# EAGLE design TapTempoMini (EAGLE 7.5.0)
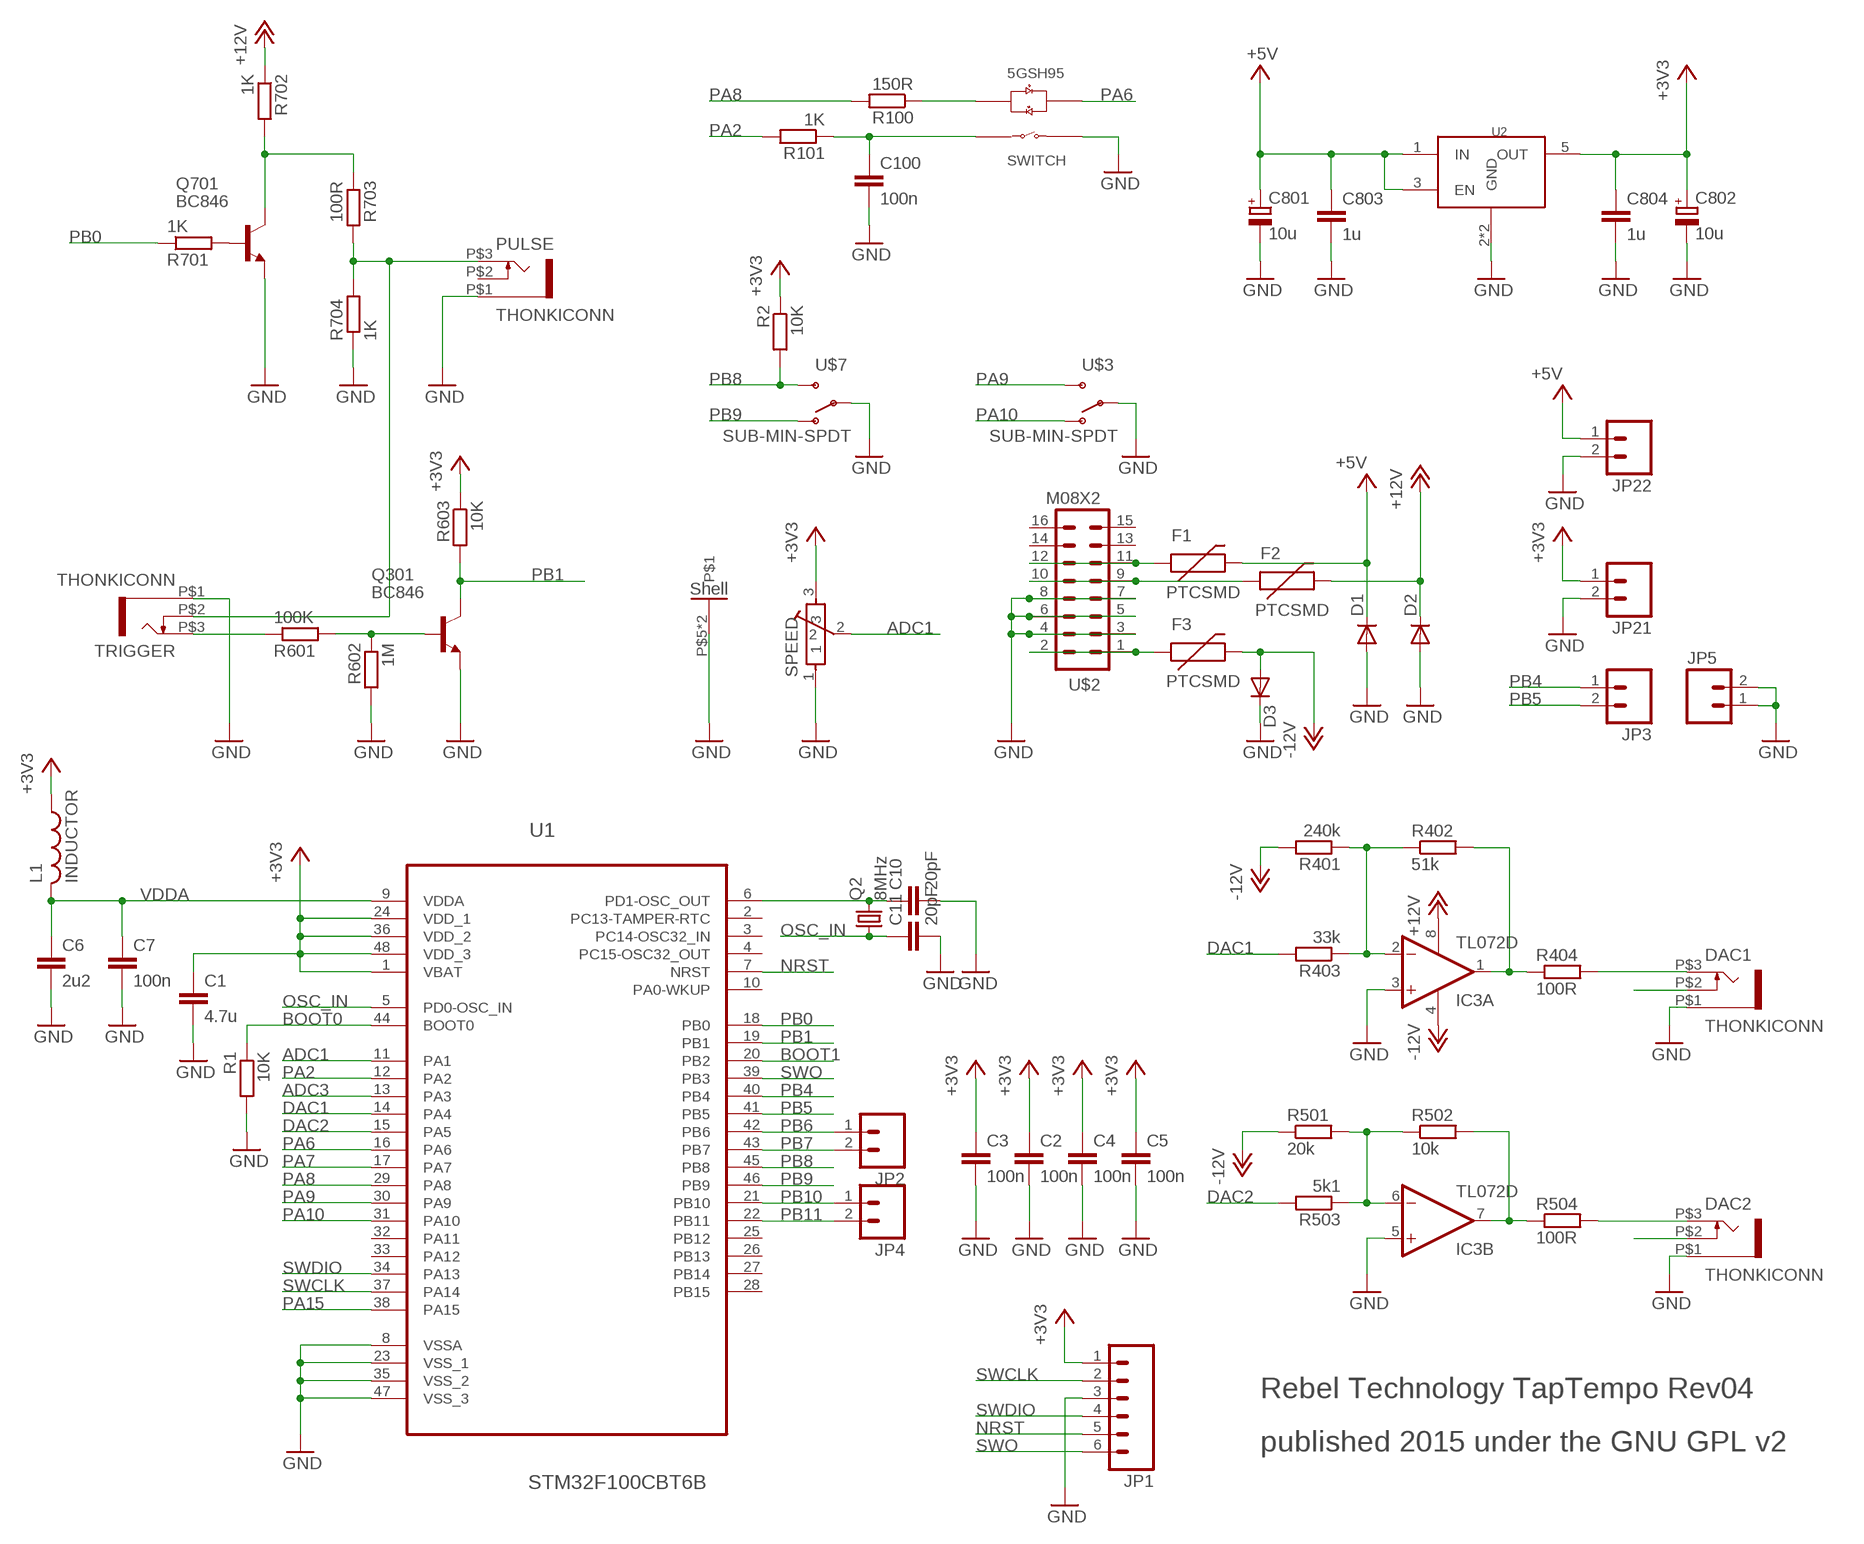
[diagram p0: schematic, sheet 1]

## Parts
C1  4.7u  C-EUC0603  [C0603]
C2  100n  C-EUC0603  [C0603]
C3  100n  C-EUC0603  [C0603]
C4  100n  C-EUC0603  [C0603]
C5  100n  C-EUC0603  [C0603]
C6  2u2  C-EUC0603  [C0603]
C7  100n  C-EUC0603  [C0603]
C10  20pF  C-EUC0603  [C0603]
C11  20pF  C-EUC0603  [C0603]
C100  100n  C-EUC0603  [C0603]
C801  10u  CPOL-EUSANYO_SMD_A5  [SANYO-OSCON_SMD_A5]
C802  10u  CPOL-EUSANYO_SMD_A5  [SANYO-OSCON_SMD_A5]
C803  1u  C-EUC0603  [C0603]
C804  1u  C-EUC0603  [C0603]
D1  DIODESMA  [SMA-DIODE]
D2  DIODESMA  [SMA-DIODE]
D3  DIODESMA  [SMA-DIODE]
DAC1  THONKICONN  [THONKICONN]
DAC2  THONKICONN  [THONKICONN]
F1  PTCSMD  [PTC-1206]
F2  PTCSMD  [PTC-1206]
F3  PTCSMD  [PTC-1206]
IC3  TL072D  [SO08]
JP1  M06SIP  [1X06]
JP2  M02PTH  [1X02]
JP3  M02PTH  [1X02]
JP4  M02PTH  [1X02]
JP5  M02PTH  [1X02]
JP21  M02PTH  [1X02]
JP22  M02PTH  [1X02]
L1  INDUCTOR  [0603]
PULSE  THONKICONN  [THONKICONN]
Q2  8MHz  CRYSTALHC49UP  [HC49UP]
Q301  BC846  [SOT23]
Q701  BC846  [SOT23]
R1  10K  R-EU_R0603  [R0603]
R2  10K  R-EU_R0603  [R0603]
R100  150R  R-EU_0603  [0603]
R101  1K  R-EU_R0603  [R0603]
R401  240k  R-EU_R0603  [R0603]
R402  51k  R-EU_R0603  [R0603]
R403  33k  R-EU_R0603  [R0603]
R404  100R  R-EU_R0603  [R0603]
R501  20k  R-EU_R0603  [R0603]
R502  10k  R-EU_R0603  [R0603]
R503  5k1  R-EU_R0603  [R0603]
R504  100R  R-EU_R0603  [R0603]
R601  100K  R-EU_R0603  [R0603]
R602  1M  R-EU_R0603  [R0603]
R603  10K  R-EU_R0603  [R0603]
R701  1K  R-EU_R0603  [R0603]
R702  1K  R-EU_R0603  [R0603]
R703  100R  R-EU_R0603  [R0603]
R704  1K  R-EU_R0603  [R0603]
SPEED  POT-ALPS-RK09L1140  [POT-ALPS-RK09L1140]
TRIGGER  THONKICONN  [THONKICONN]
U1  STM32F100CBT6B  [QFP50P900X900X160-48N]
U2  NCP702  [TSOP-5]
U$1  5GTH9  [5GTH9]
U$2  M08X2  [2X8]
U$3  SUB-MIN-SPDT  [SUB-MIN-SPDT]
U$7  SUB-MIN-SPDT  [SUB-MIN-SPDT]

## Nets
+3V3: C1.1 C2.1 C3.1 C4.1 C5.1 C802.+ C804.1 JP1.1 JP21.1 L1.1 R2.1 R603.1 SPEED.3 U1.1(VBAT) U1.24(VDD_1) U1.36(VDD_2) U1.48(VDD_3) U2.5(OUT)
+5V: C801.+ C803.1 D1.C F1.2 JP22.1 U2.1(IN) U2.3(EN)
+12V: D2.C F2.2 IC3.8(P:V+) R702.1
-12V: D3.A F3.2 IC3.4(P:V-) R401.2 R501.1
ADC1: SPEED.2 U1.11(PA1)
ADC3: U1.13(PA3)
BOOT0: R1.1 U1.44(BOOT0)
BOOT1: U1.20(PB2)
DAC1: R403.2 U1.14(PA4)
DAC2: R503.2 U1.15(PA5)
GND: C1.2 C2.2 C3.2 C4.2 C5.2 C6.2 C7.2 C10.2 C11.2 C100.2 C801.- C802.- C803.2 C804.2 D1.A D2.A D3.C DAC1.P$1 DAC2.P$1 IC3.3(A:+IN) IC3.5(B:+IN) JP1.3 JP5.1 JP5.2 JP21.2 JP22.2 PULSE.P$1 Q301.2(E) Q701.2(E) R1.2 R602.2 R704.1 SPEED.1 SPEED.P$5 SPEED.P$6 TRIGGER.P$1 U1.8(VSSA) U1.23(VSS_1) U1.35(VSS_2) U1.47(VSS_3) U2.2(GND) U2.4(GND) U$1.1(SWITCH_B) U$2.3 U$2.4 U$2.5 U$2.6 U$2.7 U$2.8 U$3.2(P) U$7.2(P)
N$1: C10.1 Q2.2 U1.6(PD1-OSC_OUT)
N$2: R100.1 U$1.-2(LED_G+)
N$3: IC3.7(B:OUT) R502.2 R504.1
N$4: IC3.6(B:-IN) R501.2 R502.1 R503.1
N$5: PULSE.P$3 R703.2 R704.2 TRIGGER.P$2
N$6: F3.1 U$2.1 U$2.2
N$7: IC3.1(A:OUT) R402.2 R404.1
N$8: DAC1.P$2
N$13: IC3.2(A:-IN) R401.1 R402.1 R403.1
N$23: R601.1 TRIGGER.P$3
N$27: Q301.1(B) R601.2 R602.1
N$29: DAC2.P$2
N$31: DAC1.P$3 R404.2
N$32: DAC2.P$3 R504.2
N$34: Q701.1(B) R701.2
N$38: Q701.3(C) R702.2 R703.1
N$44: F1.1 U$2.11 U$2.12
N$45: F2.1 U$2.9 U$2.10
NRST: JP1.5 U1.7(NRST)
OSC_IN: C11.1 Q2.1 U1.5(PD0-OSC_IN)
PA2: R101.2 U1.12(PA2)
PA6: U1.16(PA6) U$1.+3(LED_R+)
PA7: U1.17(PA7)
PA8: R100.2 U1.29(PA8)
PA9: U1.30(PA9) U$3.3(S)
PA10: U1.31(PA10) U$3.1(O)
PA15: U1.38(PA15)
PB0: R701.1 U1.18(PB0)
PB1: Q301.3(C) R603.2 U1.19(PB1)
PB4: JP3.1 U1.40(PB4)
PB5: JP3.2 U1.41(PB5)
PB6: JP2.1 U1.42(PB6)
PB7: JP2.2 U1.43(PB7)
PB8: R2.2 U1.45(PB8) U$7.3(S)
PB9: U1.46(PB9) U$7.1(O)
PB10: JP4.1 U1.21(PB10)
PB11: JP4.2 U1.22(PB11)
SWCLK: JP1.2 U1.37(PA14)
SWDIO: JP1.4 U1.34(PA13)
SWITCH_A: C100.1 R101.1 U$1.4(SWITCH_A)
SWO: JP1.6 U1.39(PB3)
VDDA: C6.1 C7.1 L1.2 U1.9(VDDA)
Unconnected: PULSE.P$2 U1.2(PC13-TAMPER-RTC) U1.3(PC14-OSC32_IN) U1.4(PC15-OSC32_OUT) U1.10(PA0-WKUP) U1.25(PB12) U1.26(PB13) U1.27(PB14) U1.28(PB15) U1.32(PA11) U1.33(PA12) U$2.13 U$2.14 U$2.15 U$2.16

## Notes on the sheet
- Rebel Technology TapTempo Rev04
- published 2015 under the GNU GPL v2

## Library data of the parts
C1-C7 C10 C11 C100 C803 C804 = resistor:C-EU: CAPACITOR, European symbol
C801 C802 = rcl:CPOL-EU: POLARIZED CAPACITOR, European symbol
D1-D3 = SparkFun:DIODE: Diode These are standard reverse protection diodes and small signal diodes. SMA package can handle up to about 1A. SOD-323 can handle about 200mA. What the SOD-323 package when ordering, there are some mfgs out there that are 5-pin packages.
DAC1 DAC2 PULSE TRIGGER = Rebel:THONKICONN
F1-F3 = SparkFun:PTC: Resettable Fuse PTC Resettable Fuse. Spark Fun Electronics SKU : COM-08357
IC3 = linear:TL072: OP AMP
JP1 = SparkFun:M06: Header 6 Standard 6-pin 0.1" header. Use with straight break away headers (SKU : PRT-00116), right angle break away headers (PRT-00553), swiss pins (PRT-00743), machine pins (PRT-00117), and female headers (PRT-00115). Molex polarized connector foot print use with SKU : PRT-08094 with associated crimp pins and housings. NOTES ON THE VARIANTS LOCK and LOCK_LONGPADS... This footprint was designed to help hold the alignment of a through-hole component (i.e. 6-pin header) while soldering it into place. You may notice that each hole has been shifted either up or down by 0.005 of an inch from it's more standard position (which is a perfectly straight line). This slight alteration caused the pins (the squares in the middle) to touch the edges of the holes. Because they are alternating, it causes a "brace" to hold the component in place. 0.005 has proven to be the perfect amount of "off-center" position when using our standard breakaway headers. Although looks a little odd when you look at the bare footprint, once you have a header in there, the alteration is very hard to notice. Also, if you push a header all the way into place, it is covered up entirely on the bottom side. This idea of altering the position of holes to aid alignment will be further integrated into the Sparkfun Library for other footprints. It can help hold any component with 3 or more connection pins.
JP2-JP5 JP21 JP22 = SparkFun:M02: Header 2 Standard 2-pin 0.1" header. Use with straight break away headers (SKU : PRT-00116), right angle break away headers (PRT-00553), swiss pins (PRT-00743), machine pins (PRT-00117), and female headers (PRT-00115). Molex polarized connector foot print use with SKU : PRT-08233 with associated crimp pins and housings.
L1 = Rebel:INDUCTOR
Q2 = crystal:CRYSTAL: CRYSTAL; FARNELL: 206-3972; OC_FARNELL: unknown; OC_NEWARK: unknown
Q301 Q701 = transistor:BC846: NPN TRANSISTOR
R1 R2 R101 R401-R404 R501-R504 R601-R603 R701-R704 = resistor:R-EU_: RESISTOR, European symbol
R100 = Rebel:R-EU_: RESISTOR, European symbol
SPEED = Rebel:POT-ALPS-RK09L
U1 = Rebel:STM32F100CBT6B: ARM-based 32-bit MCU; MPN: STM32F100CBT6B; OC_FARNELL: 1838512; OC_NEWARK: 86R1308; PACKAGE: LQFP-48; SUPPLIER: STMircroelectronics
U2 = Rebel:NCP702
U$1 = SWITCH-5GTH9:5GTH9
U$2 = SparkFun:M08X2
U$3 U$7 = Rebel:SUB-MIN-SPDT

## Board
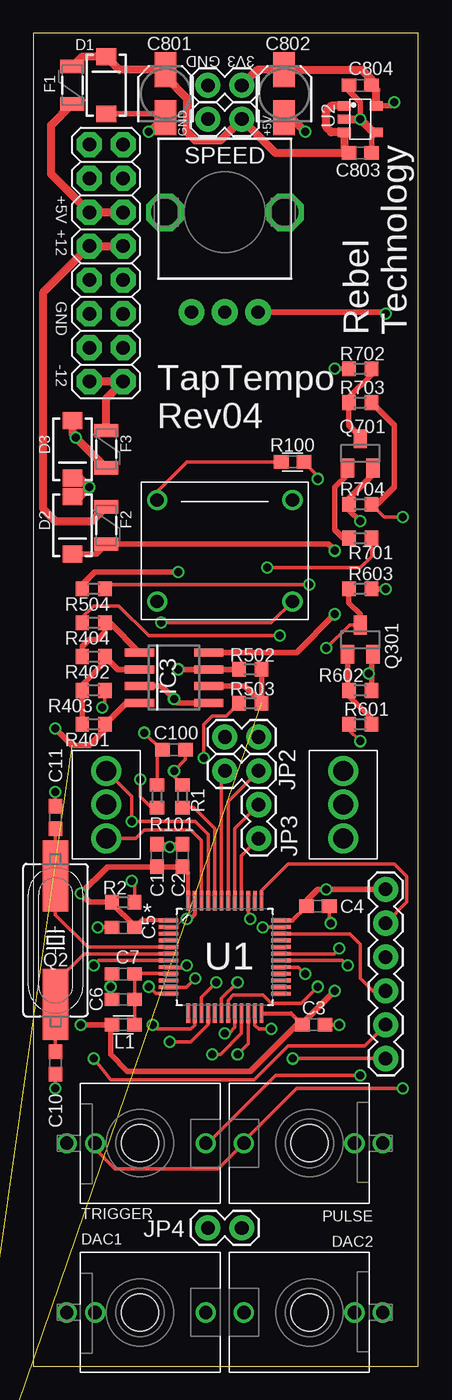
[diagram p1: board, top side]
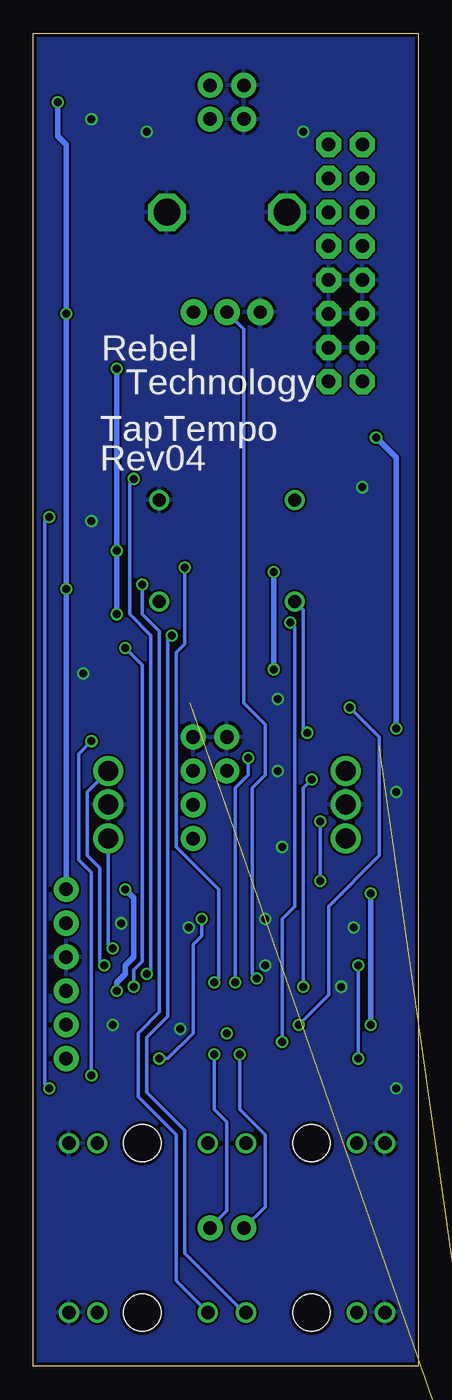
[diagram p2: board, bottom side, seen from below]

Size 28.88 x 100 mm. Coordinates in mm from the lower left corner, seen from the top.
Outline: 28.88,0 28.88,100 0,100 0,0 28.88,0
Copper layers (1+16): Top 0.035mm / dielectric 1.5mm / Bottom 0.035mm
Design rules "Rebel *": minimum track width 6mil, minimum drill 12mil, track to track 6mil, track to pad 6mil, pad to pad 6mil, via to via 6mil, smd to smd 0mil, copper to edge 10mil, drill to drill 10mil, minimum pad ring 10mil, minimum via ring 6mil, stop-mask expansion 2mil, vias tented up to drill 100mil, thermal gap 10mil

### Footprints (pad centres in the part's own frame; a part is rotated, then mirrored left to right if it is on the bottom)
C0603 = smd 1.1 x 1: 1 -0.85,0; 2 0.85,0
SANYO-OSCON_SMD_A5 = smd 2.6 x 1.6: + 1.8,0; - -1.8,0
SMA-DIODE = smd 1.27 x 1.47: A -2.15,0; C 2.15,0
THONKICONN = drill 1: P$1 0,-5.5; P$2 0,-3.38; P$3 0,4.92 | hole 2.8: 0,0
PTC-1206 = smd 1 x 1.8: 1 -1.4,0; 2 1.4,0
SO08 = smd 0.6 x 2.2: 1 -1.905,-2.6; 2 -0.635,-2.6; 3 0.635,-2.6; 4 1.905,-2.6; 5 1.905,2.6; 6 0.635,2.6; 7 -0.635,2.6; 8 -1.905,2.6
1X06 = drill 1.016 pad 1.88: 1 0,0; 2 2.54,0; 3 5.08,0; 4 7.62,0; 5 10.16,0; 6 12.7,0
1X02 = drill 1.016 pad 1.88: 1 0,0; 2 2.54,0
0603 = smd 1.1 x 1: 1 -0.85,0; 2 0.85,0
HC49UP = smd 5.334 x 1.93: 1 -4.826,0; 2 4.826,0
SOT23 = smd 1 x 1.4: 1 -0.95,-1.1; 2 0.95,-1.1; 3 0,1.1
R0603 = smd 1 x 1.1: 1 -0.85,0; 2 0.85,0
POT-ALPS-RK09L1140 = drill 1 pad 1.93: 1 -2.5,-7.5; 2 0,-7.5; 3 2.5,-7.5 | drill 2 octagon: P$5 -4.5,0; P$6 4.5,0
QFP50P900X900X160-48N = smd 1.473 x 0.279: 1 -4.216,2.743; 2 -4.216,2.261; 3 -4.216,1.753; 4 -4.216,1.245; 5 -4.216,0.762; 6 -4.216,0.254; 7 -4.216,-0.254; 8 -4.216,-0.762; 9 -4.216,-1.245; 10 -4.216,-1.753; 11 -4.216,-2.261; 12 -4.216,-2.743; 25 4.216,-2.743; 26 4.216,-2.261; 27 4.216,-1.753; 28 4.216,-1.245; 29 4.216,-0.762; 30 4.216,-0.254; 31 4.216,0.254; 32 4.216,0.762; 33 4.216,1.245; 34 4.216,1.753; 35 4.216,2.261; 36 4.216,2.743 | smd 0.279 x 1.473: 13 -2.743,-4.216; 14 -2.261,-4.216; 15 -1.753,-4.216; 16 -1.245,-4.216; 17 -0.762,-4.216; 18 -0.254,-4.216; 19 0.254,-4.216; 20 0.762,-4.216; 21 1.245,-4.216; 22 1.753,-4.216; 23 2.261,-4.216; 24 2.743,-4.216; 37 2.743,4.216; 38 2.261,4.216; 39 1.753,4.216; 40 1.245,4.216; 41 0.762,4.216; 42 0.254,4.216; 43 -0.254,4.216; 44 -0.762,4.216; 45 -1.245,4.216; 46 -1.753,4.216; 47 -2.261,4.216; 48 -2.743,4.216
TSOP-5 = smd 0.7 x 1: 1 -0.99,-1.2; 2 0,-1.2; 3 0.99,-1.2; 4 0.99,1.2; 5 -0.99,1.2
5GTH9 = drill 1: 1 5.08,3.81; 4 -5.08,-3.81; +3 5.08,-3.81; -2 -5.08,3.81
2X8 = drill 1.016 pad 1.88 octagon: 1 0,0; 2 0,2.54; 3 2.54,0; 4 2.54,2.54; 5 5.08,0; 6 5.08,2.54; 7 7.62,0; 8 7.62,2.54; 9 10.16,0; 10 10.16,2.54; 11 12.7,0; 12 12.7,2.54; 13 15.24,0; 14 15.24,2.54; 15 17.78,0; 16 17.78,2.54
SUB-MIN-SPDT = drill 1.5: 1 0,-2.54; 2 0,0; 3 0,2.54

### Placement (x,y rotation side)
C1  9.28,38.32 90 top
C2  11.19,38.32 90 top
C3  21.03,25.62 0 top
C4  21.35,34.51 0 top
C5  6.74,32.92 180 top
C6  6.74,27.52 180 top
C7  6.74,29.43 180 top
C10  1.66,22.76 270 top
C11  1.66,41.17 90 top
C100  10.55,46.25 0 top
C801  9.91,95.47 90 top
C802  18.8,95.47 90 top
C803  24.52,91.02 0 top
C804  24.52,96.1 180 top
D1  5.47,96.1 90 top
D2  2.93,63.08 270 top
D3  2.93,68.8 270 top
DAC1  8.01,4.03 270 top
DAC2  20.71,4.03 90 top
F1  2.93,96.1 90 top
F2  5.47,63.08 270 top
F3  5.47,68.8 270 top
IC3  10.55,51.65 270 top
JP1  26.43,35.78 270 top
JP2  16.9,44.67 180 top
JP3  16.9,39.59 90 top
JP4  13.09,10.38 0 top
JP5  14.36,47.21 0 top
JP21  15.63,96.1 180 top
JP22  15.63,93.56 180 top
L1  6.74,25.62 0 top
PULSE  20.71,16.73 90 top
Q2  1.66,31.97 270 top
Q301  24.52,54.51 0 top
Q701  24.52,68.48 0 top
R1  11.19,42.76 90 top
R2  6.74,34.82 0 top
R100  19.44,67.84 0 top
R101  9.28,42.76 270 top
R401  4.52,48.16 0 top
R402  4.52,53.24 180 top
R403  4.52,50.7 0 top
R404  4.52,55.78 180 top
R501  -4.05,-8.67 0 top  (outside the outline)
R502  16.27,52.29 180 top
R503  16.27,49.75 180 top
R504  4.52,58.32 0 top
R601  24.52,48.16 0 top
R602  24.52,50.7 0 top
R603  24.52,58.32 180 top
R701  24.52,62.13 180 top
R702  24.52,74.83 0 top
R703  24.52,72.29 0 top
R704  24.52,64.67 0 top
SPEED  14.36,86.58 0 top
TRIGGER  8.01,16.73 270 top
U1  14.36,30.7 0 top
U2  24.52,93.56 270 top
U$1  14.36,61.18 0 top
U$2  6.74,73.88 90 top
U$3  23.25,42.13 0 top
U$7  5.47,42.13 0 top

### Tracks (layer width: path | path; a pad name or v marks a point on that pad's centre or on a via)
+3V3  (via drill 0.6)
  Top 0.305: U1.36 19.43,33.44 C4.1 | U1.24 19.31,26.48 C3.1 | U1.1 8.11,33.44 C5.1 | U1.48 11.62,37.03 C2.1
  Top 0.406: R603.1 v26.43,58.32 | v3.56,25.62 L1.1 5.79,25.51 5.79,23.39 7.06,22.12 16.27,22.12 19.76,25.62 C3.1 20.18,25.72 v22.62,28.16 | C2.1 C1.1 5.57,37.47 v3.56,35.46 4.2,34.82 R2.1 5.89,34.72 7.59,33.02 C5.1 | C4.1 20.5,34.93 21.35,35.78 v21.98,35.78 JP1.1 | SPEED.3 26.3,79.08 v26.43,78.96 | U2.5 26.78,94.55 v27.06,94.83
  Top 0.61: JP21.1 16.8,97.27 C802.+ 24.62,97.27 25.37,96.52 C804.1 25.72,95.75 U2.5
  Bottom 0.406: v27.06,94.83 27.06,92.29 26.43,91.66 v26.43,78.96 v26.43,58.32 JP1.1 | v3.56,35.46 v3.56,25.62 | v22.62,28.16 22.62,28.79 21.98,29.43 21.98,30.06 21.35,30.7 21.35,35.14 v21.98,35.78
+5V
  Top 0.406: C801.+ 9.91,96.74
  Top 0.61: F1.2 3.68,98.25 D1.C 6.46,97.27 C801.+ | U2.1 22.34,94.55 21.98,94.2 21.98,92.93 22.34,92.57 U2.3 23.32,91.37 C803.1 18.17,91.02 JP22.1 14.04,91.97 12.14,91.97 11.5,92.61 11.5,95.15 9.91,96.74
+12V  (via drill 0.6)
  Top 0.406: R702.1 v22.62,74.83 | D2.C 4.72,60.93 F2.2 22.11,61.68 v22.62,61.18 | IC3.8 19.76,53.56 v22.62,56.41
  Bottom 0.406: v22.62,74.83 v22.62,61.18 v22.62,56.41
-12V  (via drill 0.6)  (1 unrouted)
  Top 0.406: IC3.4 6.96,49.75 R401.2 5.37,47.74 4.2,46.57 2.93,46.57 v1.66,47.84
  Top 0.61: D3.A 2.93,69.94 v3.18,69.68 F3.2
  Bottom 0.406: v1.66,47.84 1.66,68.16 v3.18,69.68
ADC1  (via drill 0.6)
  Top 0.254: U1.11 11.46,28.44 v12.14,29.11
  Bottom 0.254: v12.14,29.11 12.46,29.43 12.46,43.4 11.5,44.35 11.5,48.16 13.09,49.75 13.09,77.81 SPEED.2
BOOT0
  Top 0.254: U1.44 13.6,40.35 12.04,41.91 R1.1
BOOT1  (via drill 0.6)
  Top 0.254: U1.20 15.12,25.43 14.68,24.98 v14.36,24.98
DAC1  (via drill 0.6)
  Top 0.254: U1.14 12.1,25.58 11.82,25.3 9.28,25.3 v8.96,25.62 | R403.2 5.37,49.64 v5.15,49.43
  Bottom 0.254: v8.96,25.62 6.74,27.84 6.74,34.51 2.93,38.32 2.93,47.21 v5.15,49.43
DAC2  (via drill 0.6)
  Top 0.254: U1.15 12.61,27.67 v13.72,28.79 | v12.77,45.62 12.77,48.16 13.41,48.79 14.46,48.79 R503.2
  Bottom 0.254: v13.72,28.79 13.72,43.4 12.77,44.35 v12.77,45.62
GND  (via drill 0.6)
  Top 0.254: C6.2 5.89,28.37 v5.79,28.47 5.79,29.32 C7.2 | C2.2 10.45,39.17 v10.23,38.95 10.02,39.17 C1.2 | U1.35 17.26,32.96 v17.22,32.92 | U1.23 16.62,25.58 16.9,25.3 v17.85,25.3 | C10.2 v1.66,20.85 | C3.2 v22.93,25.62 | C11.2 v1.66,43.08 | C4.2 22.2,33.34 v22.3,33.24 | R1.2 10.55,44.25 v10.55,44.67 11.4,45.52 C100.2
  Top 0.305: U1.8 11.38,29.93 v11.5,30.06 | U1.47 12.1,33.91 11.82,33.55 v11.5,33.55 | C5.2 v4.84,32.92
  Top 0.406: Q301.2 25.37,53.31 25.37,52.18 v25.16,51.97 25.37,51.75 R602.2 | Q701.2 25.47,66.89 23.67,65.09 R704.1 23.67,64.25 v24.52,63.4 | 25.51,92.57 U2.4 25.37,92.22 C803.2 | C804.2 23.67,95.68 24.52,94.83 v24.52,93.56 | C802.- 19.34,93.67 | v8.64,92.61 9.7,93.67 C801.- 9.63,93.95 D1.A | IC3.3 9.6,51.02 v10.55,50.06 10.87,49.75 IC3.5
  Top 0.61: U2.2 v24.52,93.56 25.51,92.57 | 19.34,93.67 v20.39,92.61 | D3.C 3.49,66.65 v4.2,65.94 3.49,65.23 D2.A
  pour Bottom: 29.6,-1.05 -1.51,-1.05 -1.51,99.91 29.6,99.91
N$1
  Top 0.254: U1.6 3.82,30.95 1.66,28.79 Q2.2 C10.1
N$2
  Top 0.254: R100.1 11.5,67.84 9.28,65.62 U$1.-2
N$3  (via drill 0.6)
  Top 0.406: v10.87,52.29 IC3.7 R502.2 | v10.87,59.59 4.62,59.59 3.67,58.64 R504.1
  Bottom 0.406: v10.87,52.29 v10.87,59.59
N$4  (1 unrouted)
  Top 0.406: IC3.6 15.85,51.02 R503.1 R502.1
N$5  (via drill 0.6)
  Top 0.254: v27.7,20.85 19.76,20.85 15.79,16.89 PULSE.P$3 13.88,14.82 6.11,14.82 4.63,16.3 TRIGGER.P$2 | v27.7,63.72 26.32,63.72 R704.2
  Top 0.406: R704.2 25.79,64.67 27.06,65.94 27.06,70.6 R703.2
  Bottom 0.254: v27.7,20.85 28.01,21.17 28.01,63.4 v27.7,63.72
N$6
  Top 0.61: U$2.2 U$2.1 5.47,72.61 F3.1
N$7
  Top 0.406: R402.2 3.67,53.98 4.2,54.51 4.84,54.51 5.37,55.04 R404.1 5.73,55.78 IC3.1
N$13
  Top 0.406: IC3.2 6.32,52.29 R402.1 5.37,52.82 3.67,51.12 R403.1 R401.1
N$23  (via drill 0.6)
  Top 0.254: v24.52,21.81 18.17,21.81 13.09,16.73 TRIGGER.P$3 | R601.1 23.67,47.74 v24.52,46.89
  Bottom 0.254: v24.52,21.81 24.52,37.05 25.47,38 25.47,45.94 v24.52,46.89
N$27
  Top 0.406: Q301.1 23.57,50.8 R602.1 23.67,50.28 25.37,48.58 R601.2
N$31  (via drill 0.6)
  Top 0.254: v18.49,54.83 8.64,54.83 6.42,57.05 4.52,57.05 3.56,56.1 3.56,55.88 R404.2
  Bottom 0.254: DAC1.P$3 13.09,4.03 17.54,8.47 17.54,17.68 20.39,20.54 20.39,24.66 18.8,26.25 18.8,54.51 v18.49,54.83
N$32  (via drill 0.6)
  Top 0.254: v20.71,58.64 5.69,58.64 R504.2
  Bottom 0.254: v20.71,58.64 20.71,56.41 19.44,55.14 19.44,26.57 21.03,24.98 21.03,20.22 18.17,17.36 18.17,6.41 DAC2.P$3
N$34
  Top 0.406: Q701.1 23.57,66.89 22.62,65.94 22.62,62.76 23.25,62.13 R701.2
N$38
  Top 0.406: Q701.3 24.52,69.75 23.67,70.6 R703.1 23.67,72.71 25.37,74.41 R702.2
N$44
  Top 0.61: F1.1 1.34,93.11 1.34,89.43 U$2.12 U$2.11
N$45
  Top 0.61: F2.1 4.39,63.4 1.66,63.4 0.71,64.35 0.71,80.54 U$2.10 U$2.9
NRST  (via drill 0.6)
  Top 0.254: v4.52,23.08 5.79,21.49 16.58,21.49 19.12,24.03 24.84,24.03 JP1.5 | U1.7 4.9,30.44 v4.52,30.06
  Bottom 0.254: v4.52,30.06 v4.52,23.08
OSC_IN
  Top 0.254: C11.1 Q2.1 1.66,33.87 4.07,31.46 U1.5
PA2  (via drill 0.6)
  Top 0.254: U1.12 9.17,27.95 v8.64,28.47 | R101.2 8.86,41.91 8.01,42.76 v8.01,44.03
  Bottom 0.254: v8.64,28.47 8.64,43.4 v8.01,44.03
PA6  (via drill 0.6)
  Top 0.254: v10.23,24.35 11.82,24.35 13.12,25.64 U1.16 | U$1.+3 17.85,55.78 v9.6,55.78
  Bottom 0.254: v10.23,24.35 10.23,33.55 9.28,34.51 9.28,55.46 v9.6,55.78
PA8  (via drill 0.6)
  Top 0.254: U1.29 19.89,29.93 v20.39,29.43 | v21.35,66.57 21.35,66.79 R100.2
  Bottom 0.254: v20.39,29.43 20.08,29.74 20.08,54.83 21.66,56.41 21.66,66.26 v21.35,66.57
PA9  (via drill 0.6)
  Top 0.254: U1.30 23.19,30.44 v23.57,30.06
  Bottom 0.254: v23.57,30.06 23.89,30.38 23.89,37.36 24.84,38.32 24.84,43.08 U$3.3
PA10  (via drill 0.6)
  Top 0.254: U1.31 22.55,30.95 v22.93,31.33
  Bottom 0.254: v22.93,31.33 23.25,31.65 U$3.1
PB0  (via drill 0.6)
  Top 0.254: v15.31,28.79 14.11,27.59 U1.18 | R701.1 25.37,60.76 24.52,59.91 v17.54,59.91
  Bottom 0.254: v15.31,28.79 14.99,29.11 14.99,35.78 18.17,38.95 18.17,53.56 17.54,54.19 v17.54,59.91
PB1  (via drill 0.6)
  Top 0.254: U1.19 14.61,27.46 14.99,27.84 17.22,27.84 17.85,27.2 20.08,27.2 v21.35,28.47 | Q301.3 23.71,55.61 v21.98,53.87
  Top 0.406: R603.2 23.67,57.26 24.52,56.41 Q301.3
  Bottom 0.254: v21.35,28.47 21.35,29.74 20.71,30.38 20.71,52.6 v21.98,53.87
PB4
  Top 0.254: U1.40 15.6,38.29 JP3.1
PB5
  Top 0.254: U1.41 15.12,40.35 JP3.2
PB6
  Top 0.254: U1.42 14.61,42.38 JP2.1
PB7
  Top 0.254: U1.43 14.11,44.41 JP2.2
PB8  (via drill 0.6)
  Top 0.254: U1.45 13.12,39.88 12.14,40.86 v7.38,40.86 7.38,42.76 U$7.3 | R2.2 7.59,36.2 v7.38,36.41
  Bottom 0.254: v7.38,36.41 v7.38,40.86
PB9
  Top 0.254: U$7.1 7.69,39.59 8.33,40.22 11.82,40.22 12.61,39.43 U1.46
PB10  (via drill 0.6)
  Top 0.254: U1.21 15.6,24.96 14.04,23.39 v13.41,23.39
  Bottom 0.254: v13.41,23.39 13.41,19.27 11.5,17.36 11.5,11.96 JP4.1
PB11  (via drill 0.6)
  Top 0.254: U1.22 16.11,24.19 v15.31,23.39
  Bottom 0.254: v15.31,23.39 15.31,19.27 14.36,18.31 14.36,11.65 JP4.2
SWCLK
  Top 0.254: JP1.2 28.01,34.82 28.01,36.73 27.06,37.68 19.12,37.68 17.1,35.66 U1.37
SWDIO
  Top 0.254: U1.34 23.72,32.45 24.52,31.65 24.52,29.11 25.47,28.16 JP1.4
SWITCH_A  (via drill 0.6)
  Top 0.254: v8.33,47.52 9.6,46.25 C100.1 9.28,45.83 R101.1
  Bottom 0.254: U$1.4 8.64,56.73 8.64,47.84 v8.33,47.52
SWO  (via drill 0.6)
  Top 0.254: U1.39 16.11,33.71 v16.27,33.55 | v19.44,23.08 JP1.6
  Bottom 0.254: v16.27,33.55 16.27,32.28 16.9,31.65 16.9,24.98 18.8,23.08 v19.44,23.08
VDDA
  Top 0.254: L1.2 C6.1 C7.1 7.62,29.45 U1.9

### Text on the board
tPlace: GND | 3V3 | GND | +5V | +5V | +12 | GND | Rebel | Technology | -12 | TapTempo | Rev04
bPlace: Rebel | Technology | TapTempo | Rev04
bStop: -12